# EAGLE schematic m0dule (EAGLE 5.11)
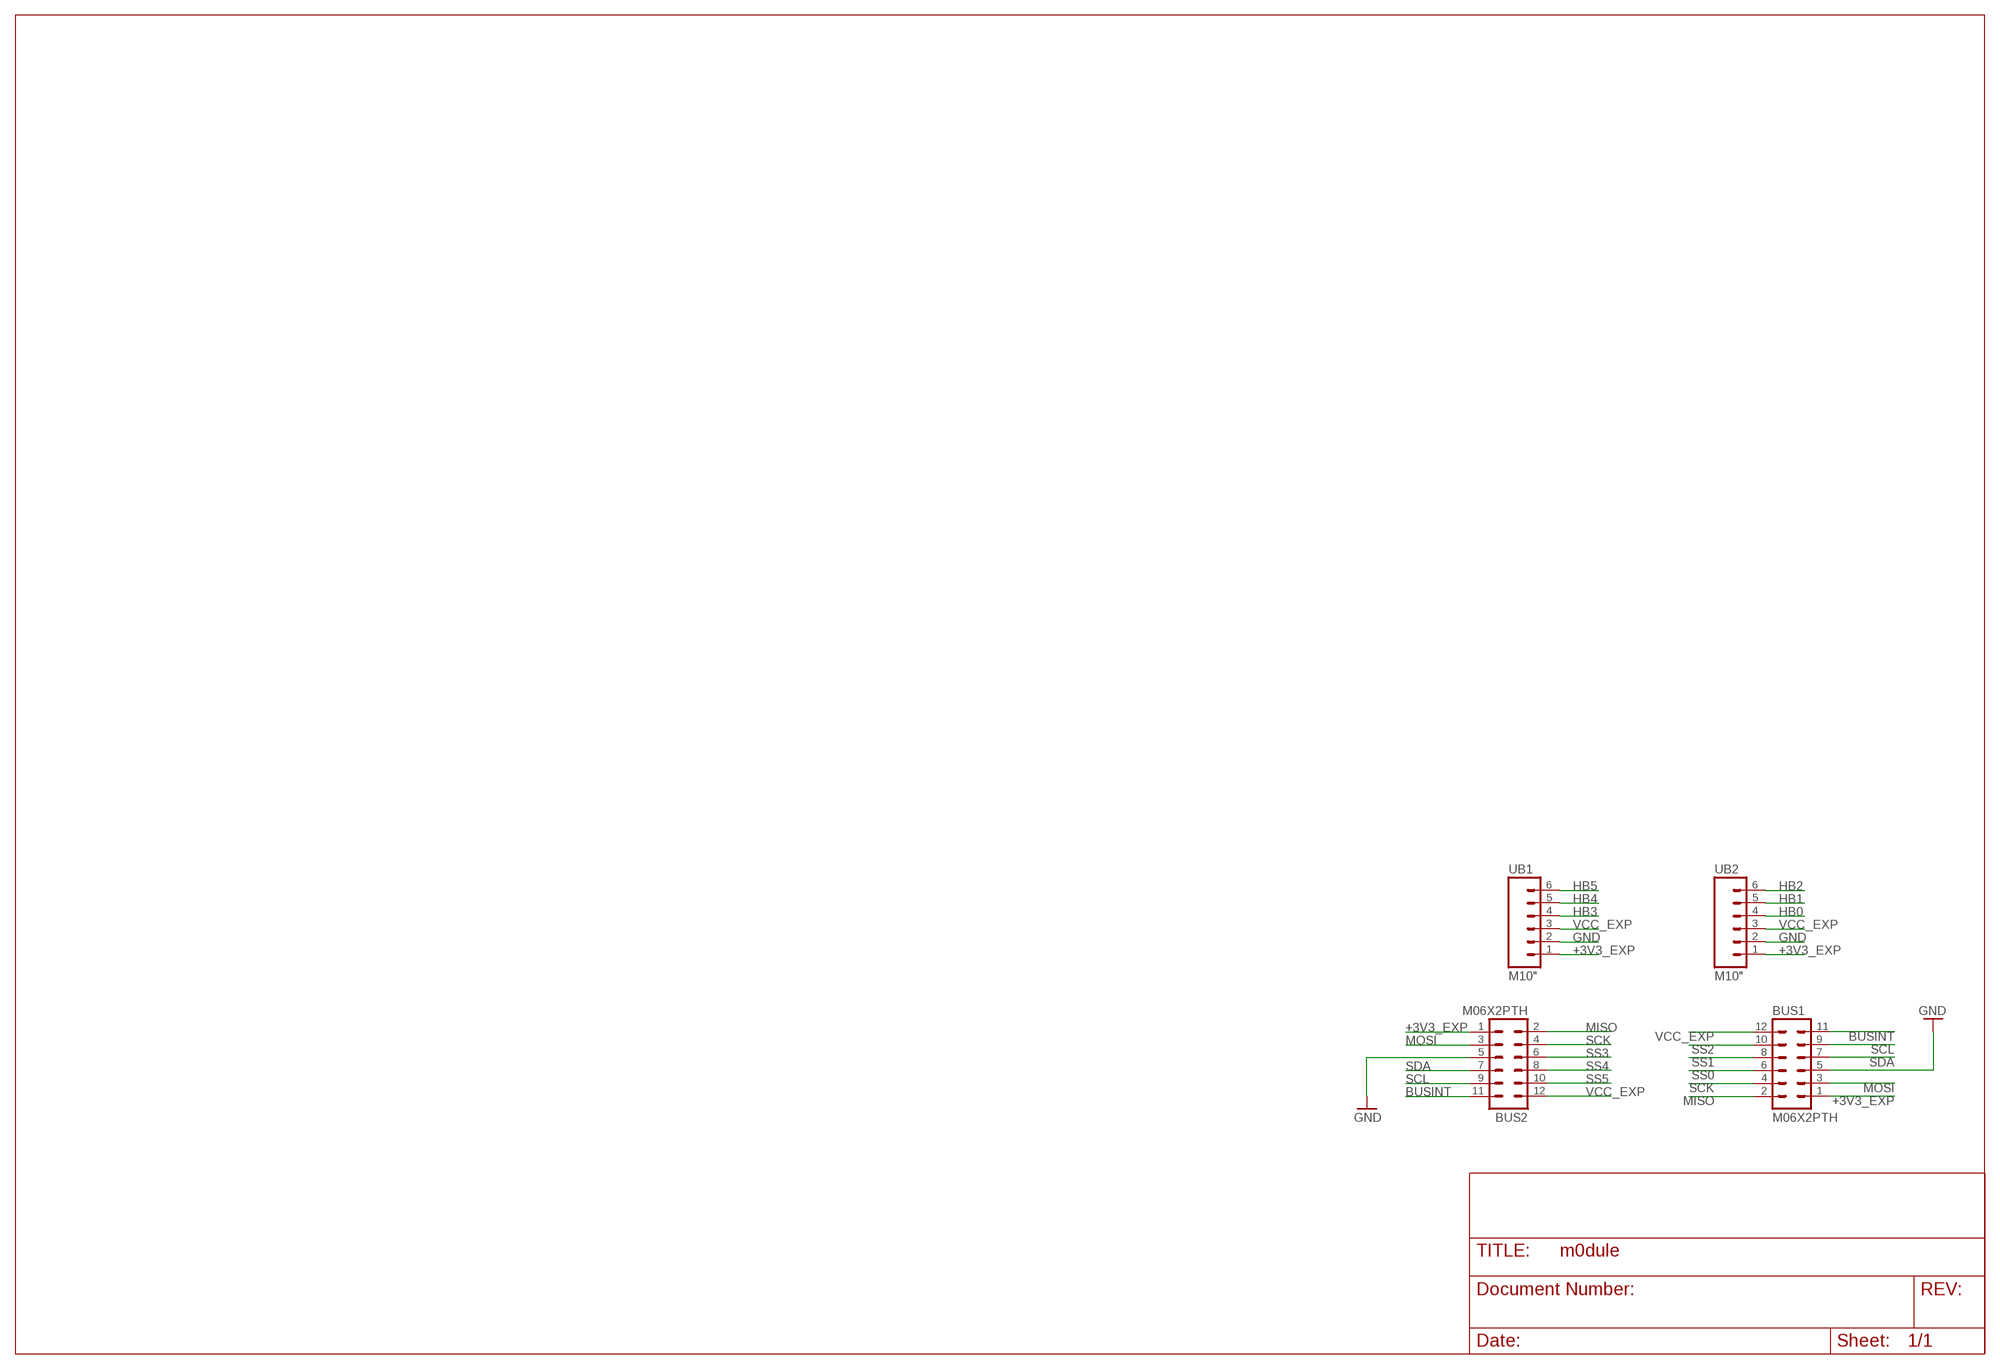
[diagram p0: schematic, sheet 1]

## Parts
BUS1  M06X2PTH  MA06-2  [MA06-2]
BUS2  M06X2PTH  MA06-2  [MA06-2]
UB1  M10"  M06SIP  [1X06]
UB2  M10"  M06SIP  [1X06]

## Nets
+3V3_EXP [FAT]: BUS1.1 BUS2.1 UB1.1 UB2.1
BUSINT: BUS1.11 BUS2.11
GND [GND/3V3]: BUS1.5 BUS2.5 UB1.2 UB2.2
HB0: UB2.4
HB1: UB2.5
HB2: UB2.6
HB3: UB1.4
HB4: UB1.5
HB5: UB1.6
MISO: BUS1.2 BUS2.2
MOSI: BUS1.3 BUS2.3
SCK: BUS1.4 BUS2.4
SCL: BUS1.9 BUS2.9
SDA: BUS1.7 BUS2.7
SS0: BUS1.6
SS1: BUS1.8
SS2: BUS1.10
SS3: BUS2.6
SS4: BUS2.8
SS5: BUS2.10
VCC_EXP [FAT]: BUS1.12 BUS2.12 UB1.3 UB2.3

## Library data of the parts
BUS1 BUS2 = con-lstb:MA06-2: PIN HEADER; OC_FARNELL: unknown; OC_NEWARK: unknown
UB1 UB2 = SparkFun:M06: Header 6 Standard 6-pin 0.1" header. Use with straight break away headers (SKU : PRT-00116), right angle break away headers (PRT-00553), swiss pins (PRT-00743), machine pins (PRT-00117), and female headers (PRT-00115). Molex polarized connector foot print use with SKU : PRT-08094 with associated crimp pins and housings. NOTES ON THE VARIANTS LOCK and LOCK_LONGPADS... This footprint was designed to help hold the alignment of a through-hole component (i.e. 6-pin header) while soldering it into place. You may notice that each hole has been shifted either up or down by 0.005 of an inch from it's more standard position (which is a perfectly straight line). This slight alteration caused the pins (the squares in the middle) to touch the edges of the holes. Because they are alternating, it causes a "brace" to hold the component in place. 0.005 has proven to be the perfect amount of "off-center" position when using our standard breakaway headers. Although looks a little odd when you look at the bare footprint, once you have a header in there, the alteration is very hard to notice. Also, if you push a header all the way into place, it is covered up entirely on the bottom side. This idea of altering the position of holes to aid alignment will be further integrated into the Sparkfun Library for other footprints. It can help hold any component with 3 or more connection pins.

## Net classes
1 FAT: width 0.2 mm, drill 0.4 mm
2 GND/3V3: width 0.2 mm, drill 0.4 mm